# EAGLE schematic solarnode (EAGLE 4.16)

## Sheet 1 of 3
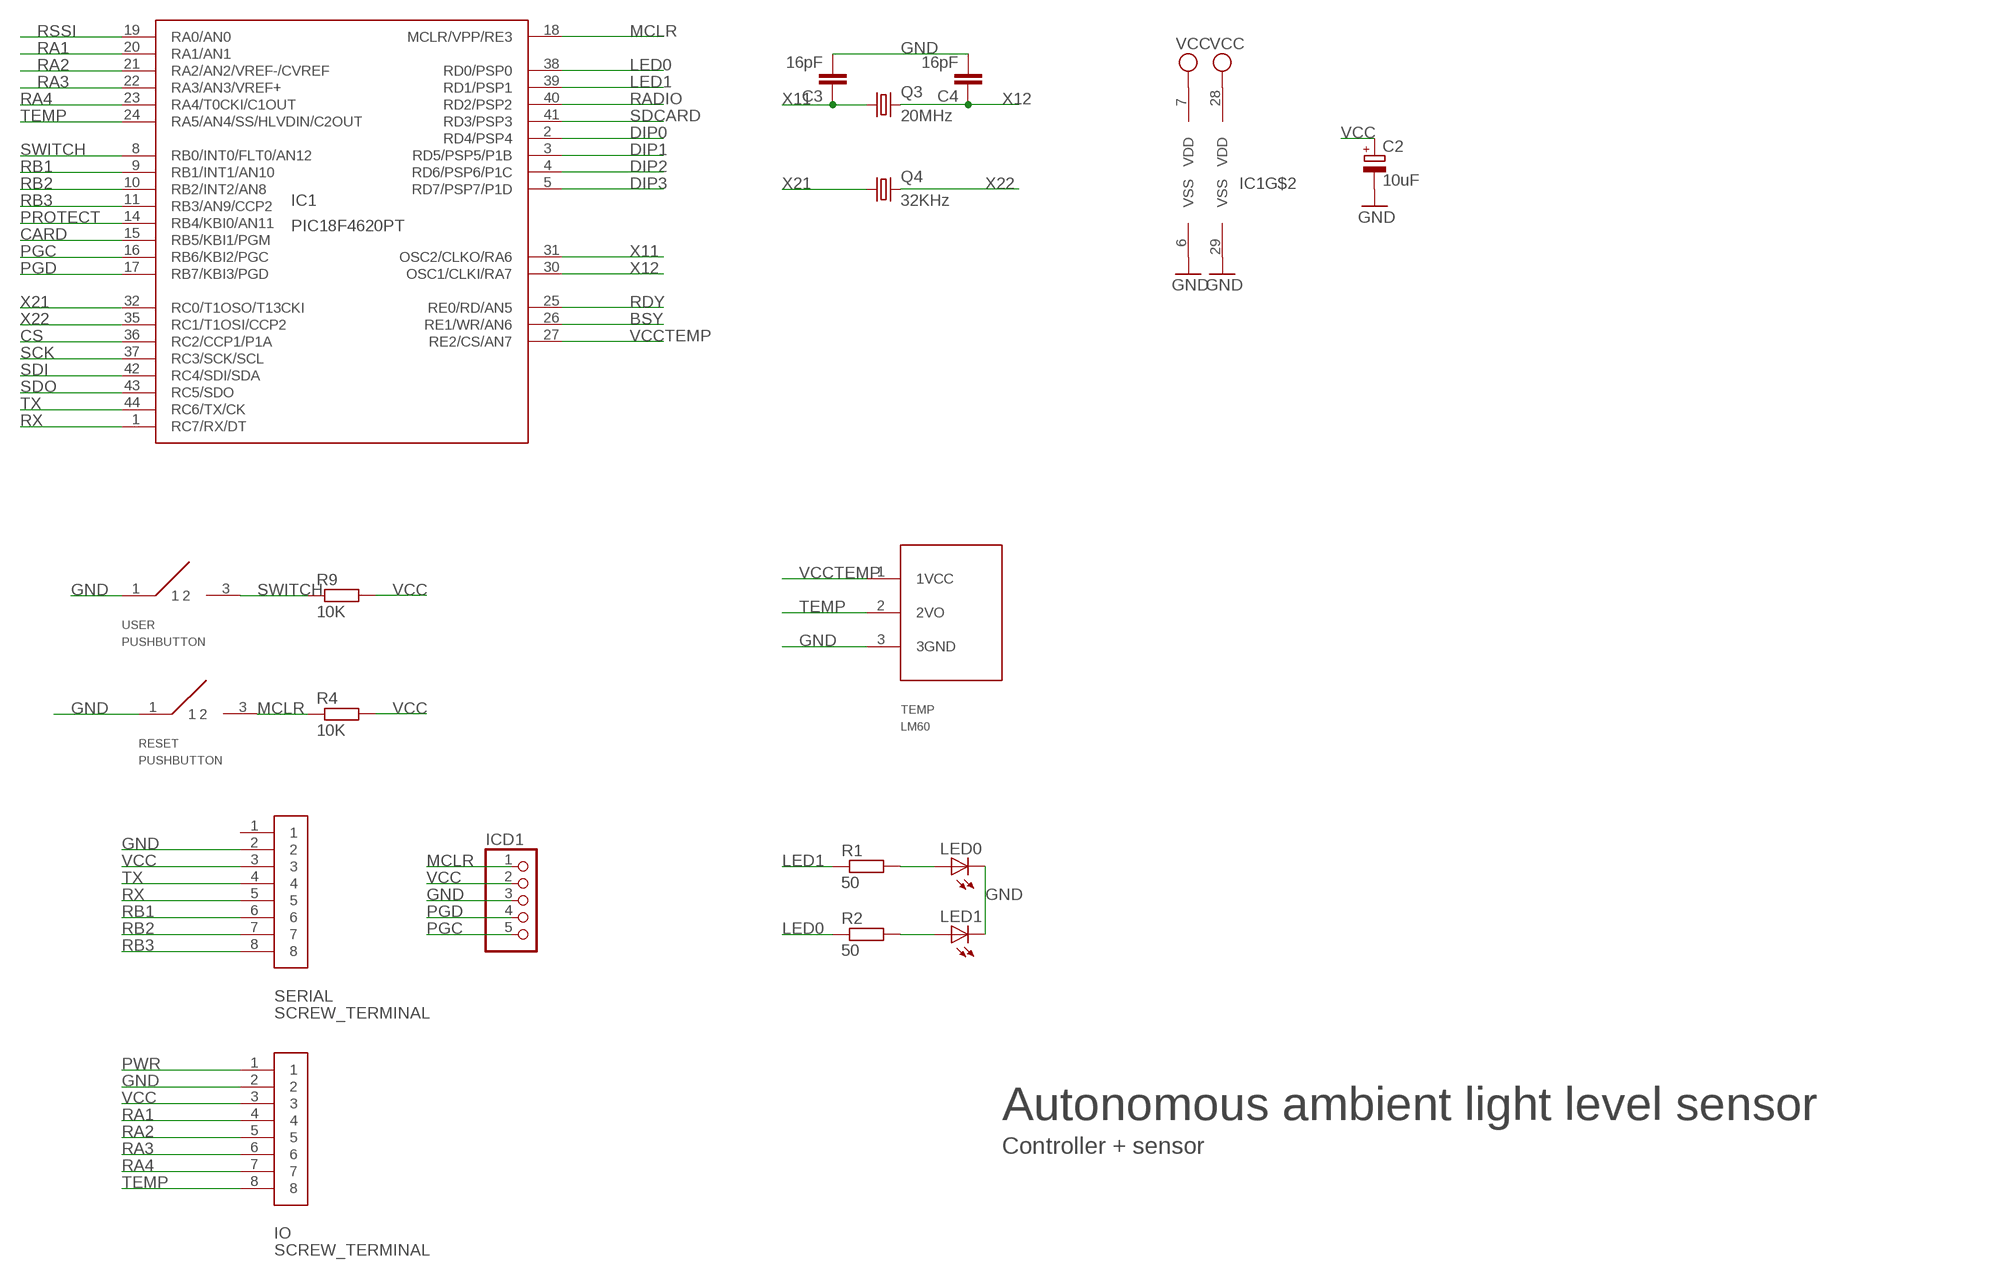
[diagram p0: schematic, sheet 1]

### Parts
C2  10uF  CPOL-EUSMCB  [SMC_B]
C3  16pF  C-EUC0603  [C0603]
C4  16pF  C-EUC0603  [C0603]
IC1  PIC18F4620PT  [TQFP44]
ICD1  PINHD-1X5  [1X05]
IO  SCREW_TERMINAL  [SCREW_TERMINAL_8PINS]
LED0  LEDCHIPLED_1206  [CHIPLED_1206]
LED1  LEDCHIPLED_1206  [CHIPLED_1206]
Q3  20MHz  CRYSTALSM49  [SM49]
Q4  32KHz  CRYSTALSM49  [SM49]
R1  50  R-EU_M1206  [M1206]
R2  50  R-EU_M1206  [M1206]
R4  10K  R-EU_M1206  [M1206]
R9  10K  R-EU_M1206  [M1206]
RESET  PUSHBUTTON  [PUSHBUTTON]
SERIAL  SCREW_TERMINAL  [SCREW_TERMINAL_8PINS]
TEMP  LM60  [SOT23]
USER  PUSHBUTTON  [PUSHBUTTON]

### Nets
BSY: IC1.26(RE1/WR/AN6) ; also sheet 2
CARD: IC1.15(RB5/KBI1/PGM)
CS: IC1.36(RC2/CCP1/P1A)
DIP0: IC1.2(RD4/PSP4)
DIP1: IC1.3(RD5/PSP5/P1B)
DIP2: IC1.4(RD6/PSP6/P1C)
DIP3: IC1.5(RD7/PSP7/P1D)
GND: C2.- C3.2 C4.2 IC1.6(VSS) IC1.29(VSS) ICD1.3 IO.2 LED0.C LED1.C RESET.1 SERIAL.2 TEMP.3(3GND) USER.1 ; also sheet 2,3
LED0: IC1.38(RD0/PSP0) R2.1
LED1: IC1.39(RD1/PSP1) R1.1
MCLR: IC1.18(MCLR/VPP/RE3) ICD1.1 R4.1 RESET.3
N$58: LED0.A R1.2
N$59: LED1.A R2.2
PGC: IC1.16(RB6/KBI2/PGC) ICD1.5
PGD: IC1.17(RB7/KBI3/PGD) ICD1.4
PROTECT: IC1.14(RB4/KBI0/AN11)
PWR: IO.1
RA1: IC1.20(RA1/AN1) IO.4
RA2: IC1.21(RA2/AN2/VREF-/CVREF) IO.5 ; also sheet 3
RA3: IC1.22(RA3/AN3/VREF+) IO.6
RA4: IC1.23(RA4/T0CKI/C1OUT) IO.7 ; also sheet 3
RADIO: IC1.40(RD2/PSP2) ; also sheet 2
RB1: IC1.9(RB1/INT1/AN10) SERIAL.6
RB2: IC1.10(RB2/INT2/AN8) SERIAL.7
RB3: IC1.11(RB3/AN9/CCP2) SERIAL.8
RDY: IC1.25(RE0/RD/AN5) ; also sheet 2
RSSI: IC1.19(RA0/AN0) ; also sheet 2
RX: IC1.1(RC7/RX/DT) SERIAL.5 ; also sheet 2
SCK: IC1.37(RC3/SCK/SCL)
SDCARD: IC1.41(RD3/PSP3)
SDI: IC1.42(RC4/SDI/SDA)
SDO: IC1.43(RC5/SDO)
SWITCH: IC1.8(RB0/INT0/FLT0/AN12) R9.1 USER.3
TEMP: IC1.24(RA5/AN4/SS/HLVDIN/C2OUT) IO.8 TEMP.2(2VO)
TX: IC1.44(RC6/TX/CK) SERIAL.4 ; also sheet 2
VCC: C2.+ IC1.7(VDD) IC1.28(VDD) ICD1.2 IO.3 R4.2 R9.2 SERIAL.3 ; also sheet 2,3
VCCTEMP: IC1.27(RE2/CS/AN7) TEMP.1(1VCC)
X11: C3.1 IC1.31(OSC2/CLKO/RA6) Q3.1
X12: C4.1 IC1.30(OSC1/CLKI/RA7) Q3.2
X21: IC1.32(RC0/T1OSO/T13CKI) Q4.1
X22: IC1.35(RC1/T1OSI/CCP2) Q4.2
Unconnected: IC1.12(NC) IC1.13(NC) IC1.33(NC) IC1.34(NC) SERIAL.1

### Notes on the sheet
- Autonomous ambient light level sensor
- Controller + sensor

## Sheet 2 of 3
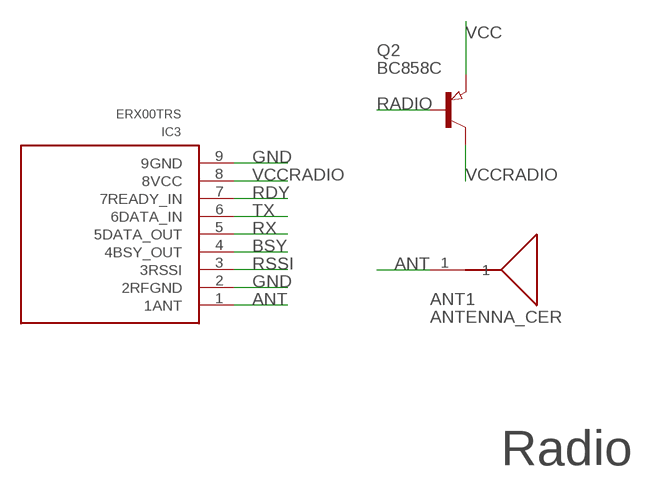
[diagram p1: schematic, sheet 2]

### Parts
ANT1  ANTENNA_CER  [ANTENNA_6PINS]
IC3  ERX00TRS  [ERX00TRS_9PINS]
Q2  BC858C  PNP-TRANSISTOR_SOT23  [SOT23]

### Nets
ANT: ANT1.1 IC3.1(1ANT)
BSY: IC3.4(4BSY_OUT) ; also sheet 1
GND: IC3.2(2RFGND) IC3.9(9GND) ; also sheet 1,3
RADIO: Q2.1(B) ; also sheet 1
RDY: IC3.7(7READY_IN) ; also sheet 1
RSSI: IC3.3(3RSSI) ; also sheet 1
RX: IC3.5(5DATA_OUT) ; also sheet 1
TX: IC3.6(6DATA_IN) ; also sheet 1
VCC: Q2.2(E) ; also sheet 1,3
VCCRADIO: IC3.8(8VCC) Q2.3(C)

### Notes on the sheet
- Radio

## Sheet 3 of 3
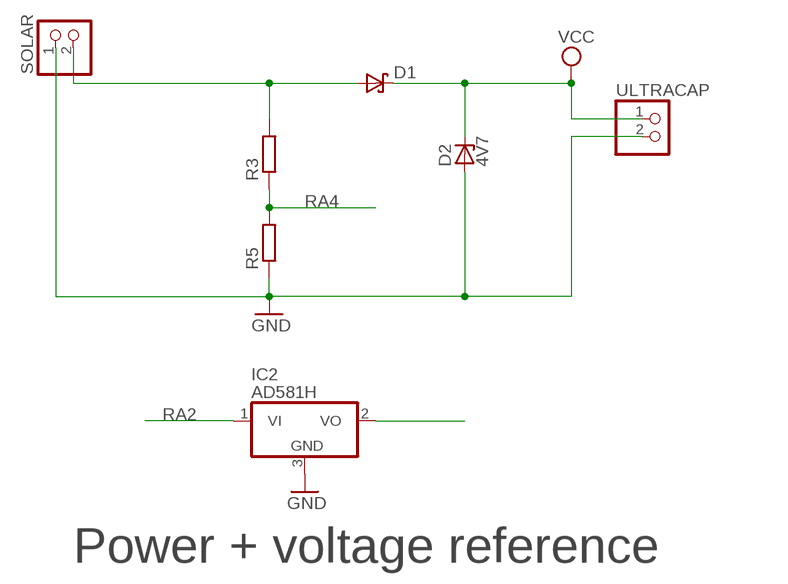
[diagram p2: schematic, sheet 3]

### Parts
D1  DS_E2L  [E2LINE]
D2  4V7  ZENER-DIODEZD-5  [ZDIO-5]
IC2  AD581H  [TO39]
R3  R-EU_0207/5V  [0207/5V]
R5  R-EU_0207/5V  [0207/5V]
SOLAR  PINHD-1X2  [1X02]
ULTRACAP  PINHD-1X2  [1X02]

### Nets
GND: D2.A IC2.3(GND) R5.1 SOLAR.1 ULTRACAP.2 ; also sheet 1,2
N$2: D1.2(A) R3.2 SOLAR.2
N$3: IC2.2(VO)
RA2: IC2.1(VI) ; also sheet 1
RA4: R3.1 R5.2 ; also sheet 1
VCC: D1.1(K) D2.C ULTRACAP.1 ; also sheet 1,2

### Notes on the sheet
- Power + voltage reference

## Library data of the parts
ANT1 = marelec:ANTENNA_CER: Ceramic 433MHz Antenna Farnell 392-28056
C2 = rcl:CPOL-EU: POLARIZED CAPACITOR, European symbol
C3 C4 = rcl:C-EU: CAPACITOR, European symbol
D1 = zetex:DS_E2L: SHOTTKY DIODE
D2 = diode:ZENER-DIODE: Z-Diode
IC1 = marelec:PIC18F4620: PIC18F4620 Microchip PIC microcontroller By Lieven Hollevoet, 2005
IC2 = linear:AD581H: VOLTAGE REFERENCE
IC3 = marelec:ERX00TRS
ICD1 = pinhead:PINHD-1X5: PIN HEADER
IO SERIAL = marelec:SCREW_TERMINAL
LED0 LED1 = led:LED: LED OSRAM: - CHIPLED LG R971, LG N971, LY N971, LG Q971, LY Q971, LO R971, LY R971 LH N974, LH R974 LS Q976, LO Q976, LY Q976 LO Q996 - Hyper CHIPLED LW Q18S LB Q993, LB Q99A, LB R99A - SideLED LS A670, LO A670, LY A670, LG A670, LP A670 LB A673, LV A673, LT A673, LW A673 LH A674 LY A675 LS A676, LA A676, LO A676, LY A676, LW A676 LS A679, LY A679, LG A679 - Hyper Micro SIDELED® LS Y876, LA Y876, LO Y876, LY Y876 LT Y87S - SmartLED LW L88C, LW L88S LB L89C, LB L89S, LG L890 LS L89K, LO L89K, LY L89K LS L896, LA L896, LO L896, LY L896 - TOPLED LS T670, LO T670, LY T670, LG T670, LP T670 LSG T670, LSP T670, LSY T670, LOP T670, LYG T670 LG T671, LOG T671, LSG T671 LB T673, LV T673, LT T673, LW T673 LH T674 LS T676, LA T676, LO T676, LY T676, LB T676, LH T676, LSB T676, LW T676 LB T67C, LV T67C, LT T67C, LS T67K, LO T67K, LY T67K, LW E67C LS E67B, LA E67B, LO E67B, LY E67B, LB E67C, LV E67C, LT E67C LW T67C LS T679, LY T679, LG T679 LS T770, LO T770, LY T770, LG T770, LP T770 LB T773, LV T773, LT T773, LW T773 LH T774 LS E675, LA E675, LY E675, LS T675 LS T776, LA T776, LO T776, LY T776, LB T776 LHGB T686 LT T68C, LB T68C - Hyper Mini TOPLED® LB M676 - Mini TOPLED Santana® LG M470 LS M47K, LO M47K, LY M47K Source: http://www.osram.convergy.de - LUMILED® LXK2-PW12-R00, LXK2-PW12-S00, LXK2-PW14-U00, LXK2-PW14-V00 LXK2-PM12-R00, LXK2-PM12-S00, LXK2-PM14-U00 LXK2-PE12-Q00, LXK2-PE12-R00, LXK2-PE12-S00, LXK2-PE14-T00, LXK2-PE14-U00 LXK2-PB12-K00, LXK2-PB12-L00, LXK2-PB12-M00, LXK2-PB14-N00, LXK2-PB14-P00, LXK2-PB14-Q00 LXK2-PR12-L00, LXK2-PR12-M00, LXK2-PR14-Q00, LXK2-PR14-R00 LXK2-PD12-Q00, LXK2-PD12-R00, LXK2-PD12-S00 LXK2-PH12-R00, LXK2-PH12-S00 LXK2-PL12-P00, LXK2-PL12-Q00, LXK2-PL12-R00 Source: www.luxeon.com
Q2 = semicon-smd-ipc:PNP-TRANSISTOR_: PNP TRANSISTOR
Q3 Q4 = crystal:CRYSTAL: CRYSTAL
R1-R5 R9 = rcl:R-EU_: RESISTOR, European symbol
RESET USER = marelec:PUSHBUTTON
SOLAR ULTRACAP = pinhead:PINHD-1X2: PIN HEADER
TEMP = marelec:LM60